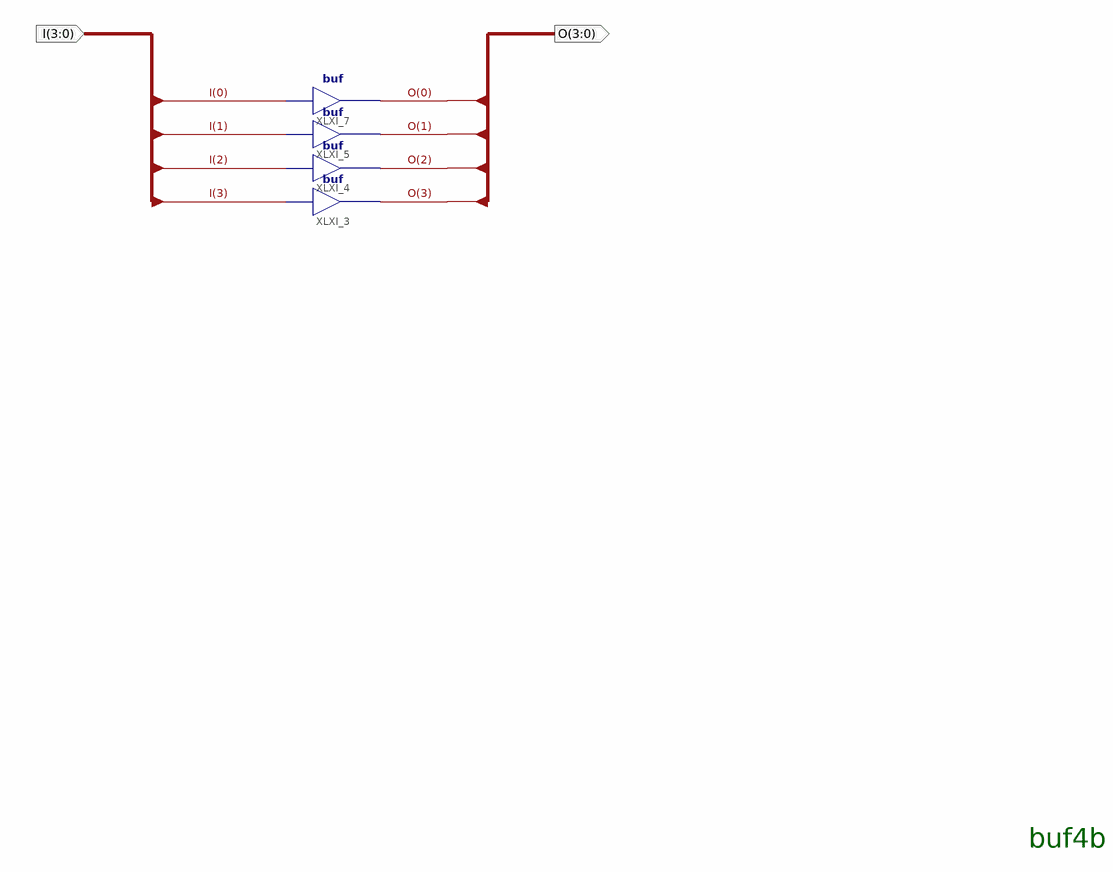
[diagram p0: schematic sheet 1]
// Xilinx ISE schematic buf4b.sch (spartan6) as structural Verilog: 4 symbols, 2 ports
module buf4b (
  input  [3:0] I,
  output [3:0] O
);

  buf XLXI_3 (O[3], I[3]);
  buf XLXI_4 (O[2], I[2]);
  buf XLXI_5 (O[1], I[1]);
  buf XLXI_7 (O[0], I[0]);

  // Notes on the sheet:
  //   buf4b
endmodule
